# EAGLE design ATMega32U4-CC3000 (EAGLE 6.4)
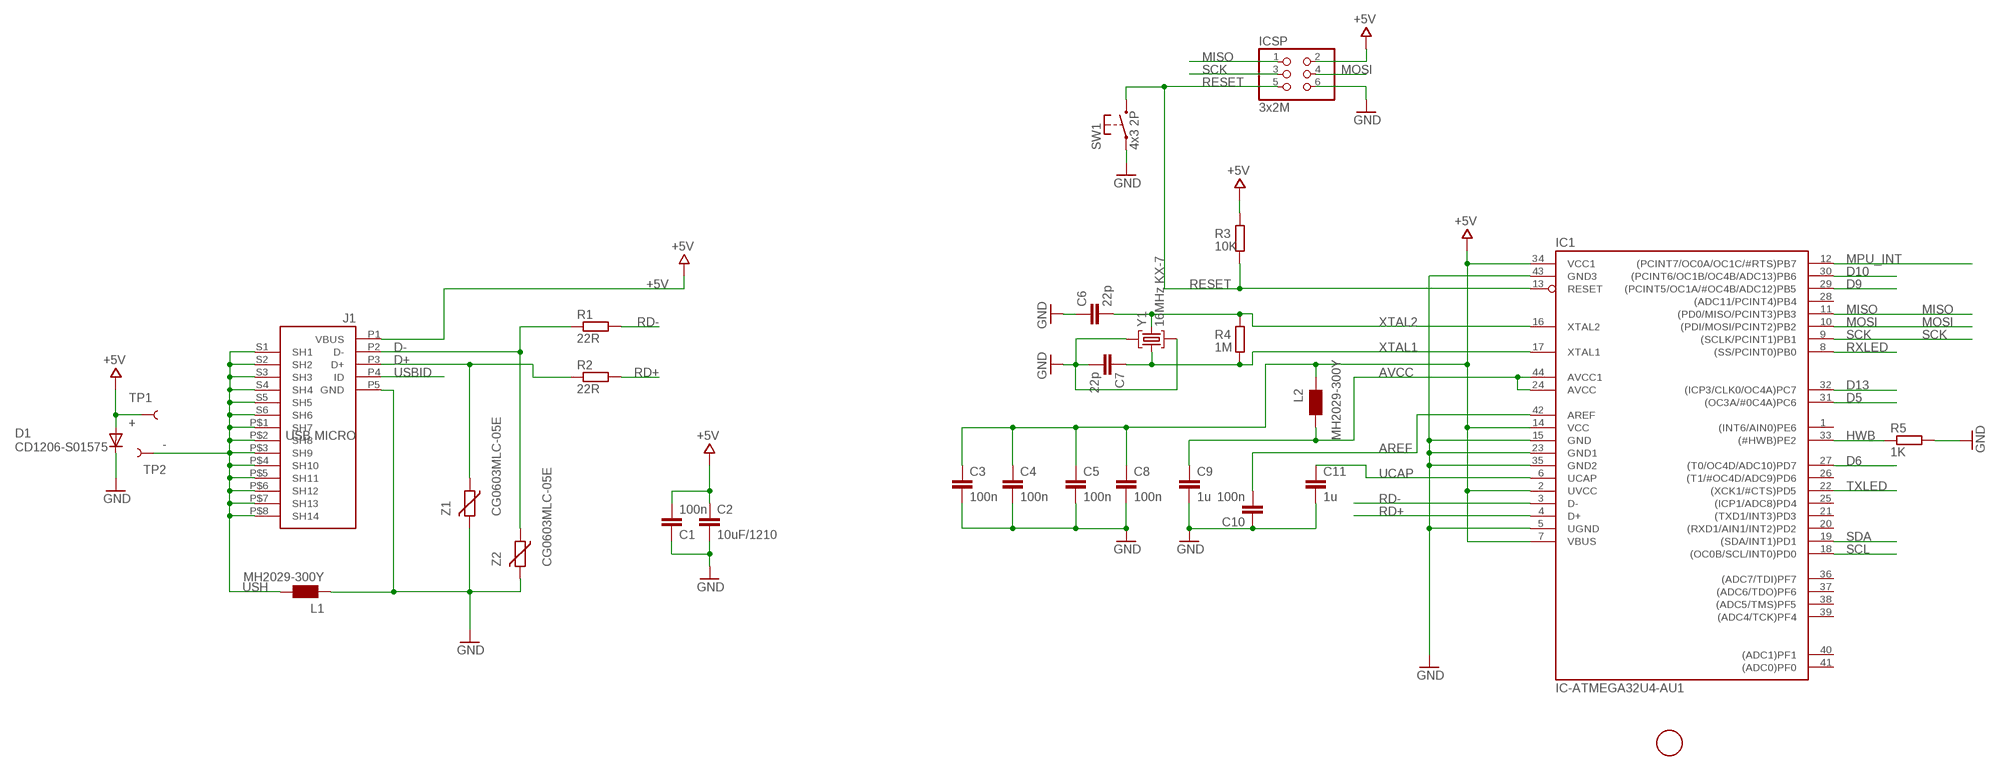
[diagram p0: schematic, sheet 1, part 1 of 2]
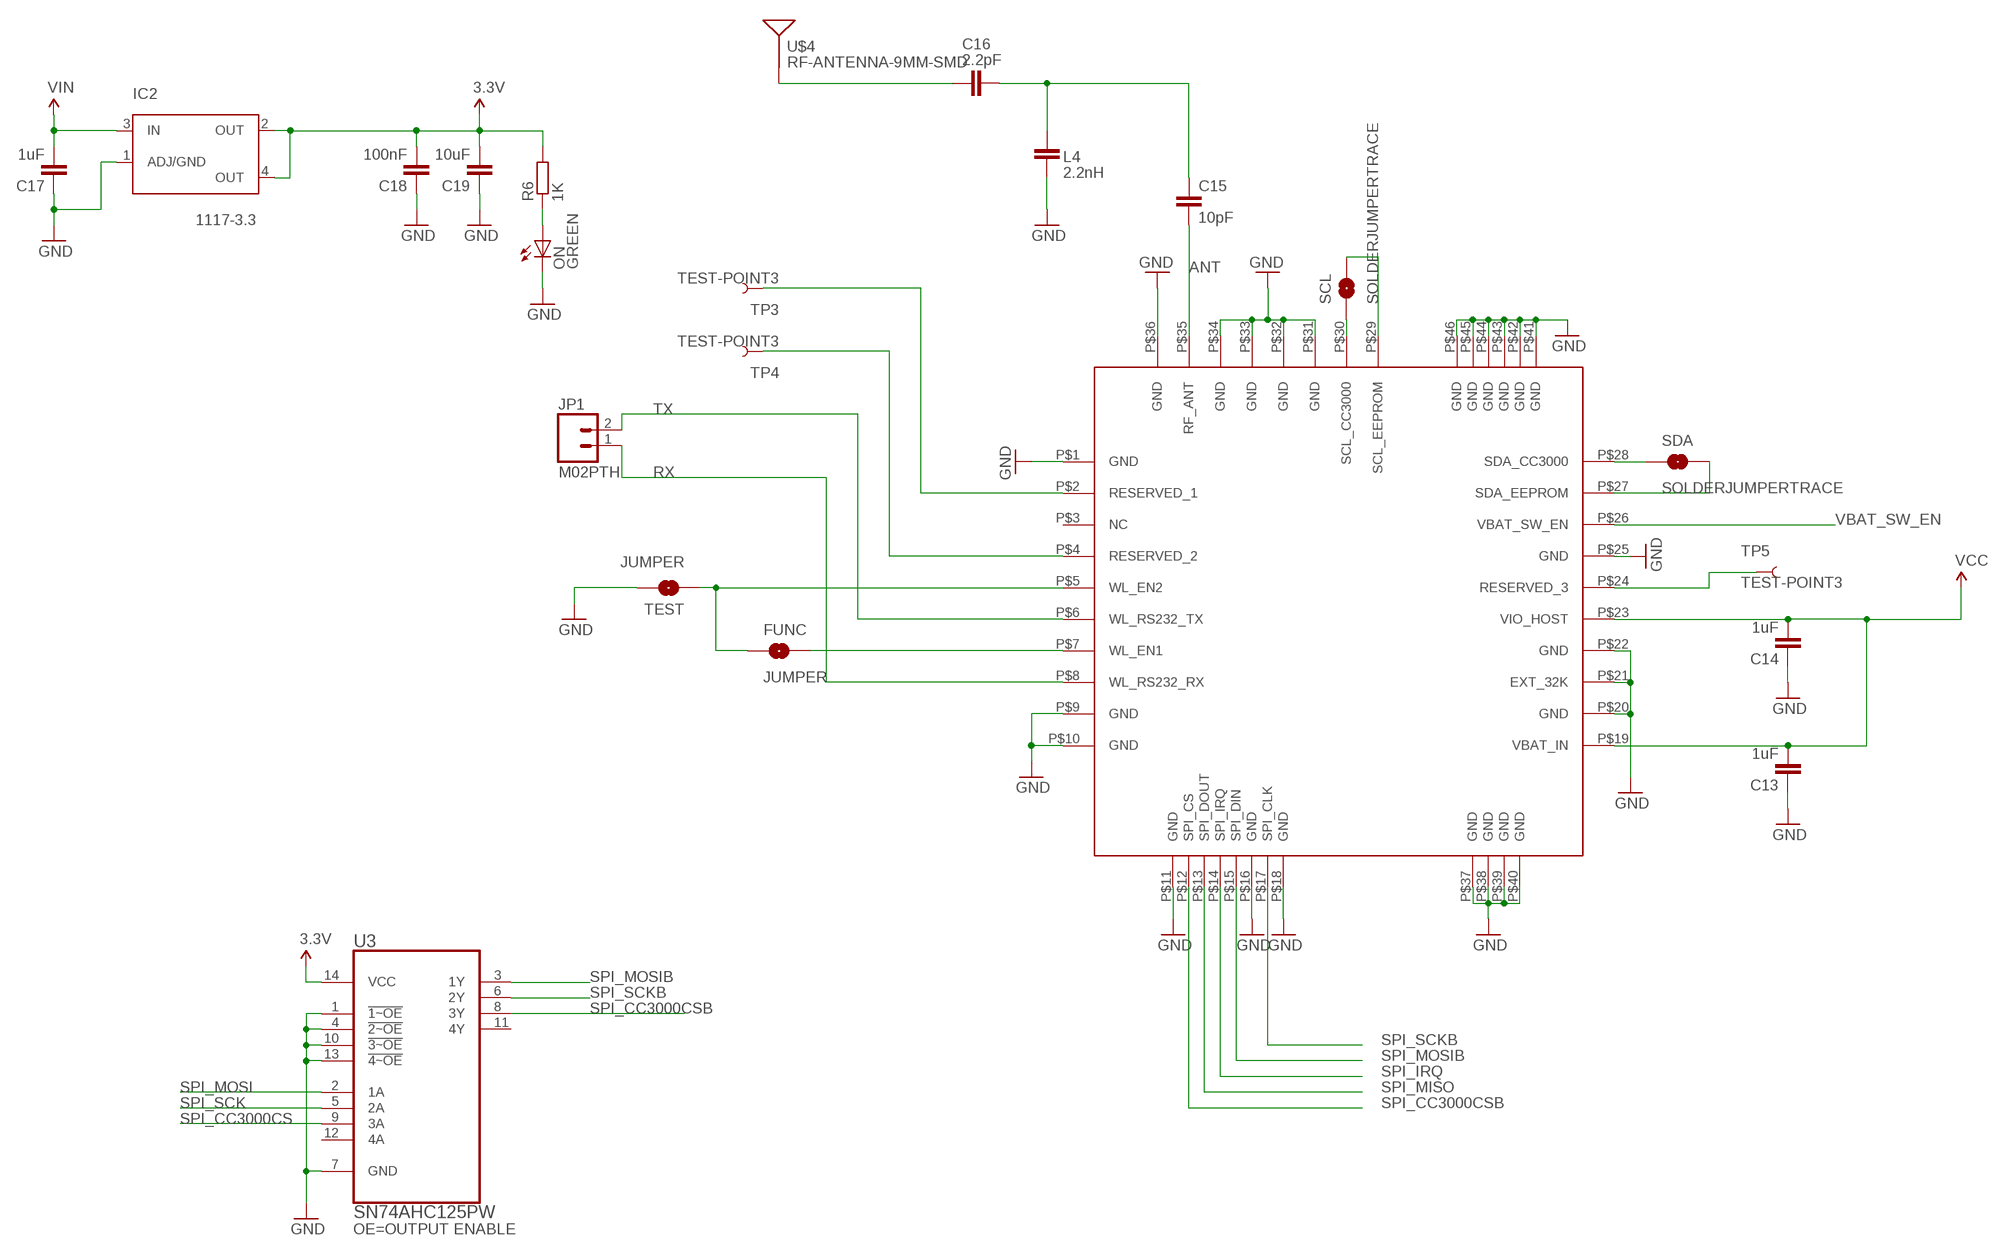
[diagram p1: schematic, sheet 1, part 2 of 2]

## Parts
C1  100n  C-EUC0603  [C0603-ROUND]
C2  10uF/1210  CAPACITOR1210  [CAP-1210_SMC-B-SMT]
C3  100n  CAPACITOR0402  [CAP-0402-SMT-ROUND]
C4  100n  CAPACITOR0402  [CAP-0402-SMT-ROUND]
C5  100n  CAPACITOR0402  [CAP-0402-SMT-ROUND]
C6  22p  CAPACITOR0402  [CAP-0402-SMT-ROUND]
C7  22p  CAPACITOR0402  [CAP-0402-SMT-ROUND]
C8  100n  CAPACITOR0402  [CAP-0402-SMT-ROUND]
C9  1u  CAPACITOR0402  [CAP-0402-SMT-ROUND]
C10  100n  CAPACITOR0402  [CAP-0402-SMT-ROUND]
C11  1u  CAPACITOR0402  [CAP-0402-SMT-ROUND]
C13  1uF  CAPACITOR0603  [CAP-0603-SMT-ROUND]
C14  1uF  CAPACITOR0603  [CAP-0603-SMT-ROUND]
C15  10pF  CAPACITOR0603  [CAP-0603-SMT-ROUND]
C16  2.2pF  CAPACITOR0603  [CAP-0603-SMT-ROUND]
C17  1uF  CAPACITOR0603  [CAP-0603-SMT-ROUND]
C18  100nF  CAPACITOR0603  [CAP-0603-SMT-ROUND]
C19  10uF  CAPACITOR1210  [CAP-1210_SMC-B-SMT]
D1  CD1206-S01575  DIODE-SWITCHINGCD1206-S01575  [DIODE-1206-SMT]
FID1  FIDUCIALMOUNT  [FIDUCIA-MOUNT]
FUNC  JUMPER  SOLDERJUMPERTRACE  [SJ_2S-TRACE]
IC1  IC-ATMEGA32U4-AU1  [QFP-10X10-44P]
IC2  1117-3.3  LDO-AMS1117-X  [LDO-SOT223]
ICSP  3x2M  PINHD-2X3  [2X03]
J1  USB MICRO  MYCON2_USB-MINI-B  [CON2_USB_MICRO_B_AT]
JP1  M02PTH  [1X02]
L1  MH2029-300Y  WE-CBF_0805  [0805]
L2  MH2029-300Y  WE-CBF_0805  [0805]
L4  2.2nH  CAPACITOR0603  [CAP-0603-SMT-ROUND]
ON  GREEN  DIODE-LED0805  [LED-0805-SMT]
R1  22R  RESISTOR0402  [RESISTOR-0402-SMT-ROUND]
R2  22R  RESISTOR0402  [RESISTOR-0402-SMT-ROUND]
R3  10K  RESISTOR0402  [RESISTOR-0402-SMT-ROUND]
R4  1M  RESISTOR0402  [RESISTOR-0402-SMT-ROUND]
R5  1K  RESISTOR0402  [RESISTOR-0402-SMT-ROUND]
R6  1K  RESISTOR0603  [RESISTOR-0603-SMT-ROUND]
SCL  SOLDERJUMPERTRACE  [SJ_2S-TRACE]
SDA  SOLDERJUMPERTRACE  [SJ_2S-TRACE]
SW1  4x3 2P  SWITCH-2P2.1-SMT  [SWITCH-2.1-SMT]
TEST  JUMPER  SOLDERJUMPERNO  [SJ_2S-NO]
TP1  +  TEST-POINT3X5  [PAD.03X.05]
TP2  -  TEST-POINT3X5  [PAD.03X.05]
TP3  TEST-POINT3  [PAD.03X.03]
TP4  TEST-POINT3  [PAD.03X.03]
TP5  TEST-POINT3  [PAD.03X.03]
U1  CC3000  [CC3000]
U3  SN74AHC125PW  IC-TI-SN74AHC125PW  [SOP65P640X120-14N]
U$4  RF-ANTENNA-9MM-SMD  [RF-ANTENNA-9MM]
Y1  16MHz KX-7  CRYSTAL-3.2-2.5  [CRYSTAL-3.2-2.5]
Z1  CG0603MLC-05E  VARISTORCN0603  [CT/CN0603]
Z2  CG0603MLC-05E  VARISTORCN0603  [CT/CN0603]

## Nets
3.3V: C13.2 C14.2 C18.2 C19.- IC2.2(OUT) IC2.4(OUT) R6.2 U1.P$19(VBAT_IN) U1.P$23(VIO_HOST) U3.14(VCC) ; supply symbol labelled VCC
+5V [vcc]: C1.2 C2.+ C3.1 C4.1 C5.1 C8.1 D1.A IC1.2(UVCC) IC1.7(VBUS) IC1.14(VCC) IC1.34(VCC1) ICSP.2 J1.P1(VBUS) L2.1 R3.1 TP1.P$1
ANT [antenna]: C15.2 U1.P$35(RF_ANT)
AREF [aref]: C10.2 IC1.42(AREF)
AVCC: C9.1 IC1.24(AVCC) IC1.44(AVCC1) L2.2
D5: IC1.31((OC3A/#0C4A)PC6)
D6: IC1.27((T0/OC4D/ADC10)PD7)
D9: IC1.29((PCINT5/OC1A/#OC4B/ADC12)PB5)
D10: IC1.30((PCINT6/OC1B/OC4B/ADC13)PB6)
D13: IC1.32((ICP3/CLK0/OC4A)PC7)
D+: J1.P3(D+) R2.1 Z1.1
D-: J1.P2(D-) R1.1 Z2.1
GND [antenna]: C1.1 C2.- C3.2 C4.2 C5.2 C6.1 C7.2 C8.2 C9.2 C10.1 C11.2 C13.1 C14.1 C17.1 C18.1 C19.+ D1.C IC1.5(UGND) IC1.15(GND) IC1.23(GND1) IC1.35(GND2) IC1.43(GND3) IC2.1(ADJ/GND) ICSP.6 J1.P5(GND) L1.1 L4.1 ON.C R5.2 SW1.1 TEST.2 U1.P$1(GND) U1.P$9(GND) U1.P$10(GND) U1.P$11(GND) U1.P$16(GND) U1.P$18(GND) U1.P$20(GND) U1.P$21(EXT_32K) U1.P$22(GND) U1.P$25(GND) U1.P$31(GND) U1.P$32(GND) U1.P$33(GND) U1.P$34(GND) U1.P$36(GND) U1.P$37(GND) U1.P$38(GND) U1.P$39(GND) U1.P$40(GND) U1.P$41(GND) U1.P$42(GND) U1.P$43(GND) U1.P$44(GND) U1.P$45(GND) U1.P$46(GND) U3.1(!1~OE) U3.4(!2~OE) U3.7(GND) U3.10(!3~OE) U3.13(!4~OE) Y1.2(GND) Y1.4(GND) Z1.2 Z2.2
HWB: IC1.33((#HWB)PE2) R5.1
MISO: IC1.11((PD0/MISO/PCINT3)PB3) ICSP.1
MOSI: IC1.10((PDI/MOSI/PCINT2)PB2) ICSP.4
MPU_INT: IC1.12((PCINT7/OC0A/OC1C/#RTS)PB7)
N$1: FUNC.2 U1.P$7(WL_EN1)
N$2: FUNC.1 TEST.1 U1.P$5(WL_EN2)
N$3 [1.8v]: TP3.P$1 U1.P$2(RESERVED_1)
N$4 [1.8v]: TP4.P$1 U1.P$4(RESERVED_2)
N$7 [1.8v]: TP5.P$1 U1.P$24(RESERVED_3)
N$8: ON.A R6.1
N$10 [antenna]: C15.1 C16.2 L4.2
N$14 [1.8v]: SCL.1 U1.P$30(SCL_CC3000)
N$15 [antenna]: C16.1 U$4.SIG(SIGNAL)
N$16 [1.8v]: SCL.2 U1.P$29(SCL_EEPROM)
N$17 [1.8v]: SDA.1 U1.P$28(SDA_CC3000)
N$18 [1.8v]: SDA.2 U1.P$27(SDA_EEPROM)
RD+: IC1.4(D+) R2.2
RD-: IC1.3(D-) R1.2
RESET: IC1.13(RESET) ICSP.5 R3.2 SW1.2
RX [1.8v]: JP1.1 U1.P$8(WL_RS232_RX)
RXLED: IC1.8((SS/PCINT0)PB0)
SCK: IC1.9((SCLK/PCINT1)PB1) ICSP.3
SCL: IC1.18((OC0B/SCL/INT0)PD0)
SDA: IC1.19((SDA/INT1)PD1)
SPI_CC3000CS: U3.9(3A)
SPI_CC3000CSB: U1.P$12(SPI_CS) U3.8(3Y)
SPI_IRQ: U1.P$14(SPI_IRQ)
SPI_MISO: U1.P$13(SPI_DOUT)
SPI_MOSI: U3.2(1A)
SPI_MOSIB: U1.P$15(SPI_DIN) U3.3(1Y)
SPI_SCK: U3.5(2A)
SPI_SCKB: U1.P$17(SPI_CLK) U3.6(2Y)
TX [1.8v]: JP1.2 U1.P$6(WL_RS232_TX)
TXLED: IC1.22((XCK1/#CTS)PD5)
UCAP: C11.1 IC1.6(UCAP)
USBID: J1.P4(ID)
USH [antenna]: J1.P$1(SH7) J1.P$2(SH8) J1.P$3(SH9) J1.P$4(SH10) J1.P$5(SH11) J1.P$6(SH12) J1.P$7(SH13) J1.P$8(SH14) J1.S1(SH1) J1.S2(SH2) J1.S3(SH3) J1.S4(SH4) J1.S5(SH5) J1.S6(SH6) L1.2 TP2.P$1
VBAT_SW_EN: U1.P$26(VBAT_SW_EN)
VIN: C17.2 IC2.3(IN)
XTAL1: C7.1 IC1.17(XTAL1) R4.1 Y1.1(C1)
XTAL2: C6.2 IC1.16(XTAL2) R4.2 Y1.3(C2)
Unconnected: IC1.1((INT6/AIN0)PE6) IC1.20((RXD1/AIN1/INT2)PD2) IC1.21((TXD1/INT3)PD3) IC1.25((ICP1/ADC8)PD4) IC1.26((T1/#OC4D/ADC9)PD6) IC1.28((ADC11/PCINT4)PB4) IC1.36((ADC7/TDI)PF7) IC1.37((ADC6/TDO)PF6) IC1.38((ADC5/TMS)PF5) IC1.39((ADC4/TCK)PF4) IC1.40((ADC1)PF1) IC1.41((ADC0)PF0) U1.P$3(NC) U3.11(4Y) U3.12(4A)

## Library data of the parts
C1 = SmartPrj:C-EU: CAPACITOR, European symbol
C2-C11 C13-C19 L4 = TONYLABS:CAPACITOR: CAPACITOR
D1 = TONYLABS:DIODE-SWITCHING: Diode; DATASHEET: http://www.bourns.com/data/global/pdfs/cd0805_1206.pdf; FUNCTION: Switching Chip Diode; MAX_VOLTAGE: 75V; PACKAGE: 1206; SUPLLIER: BOURNS
FID1 = SmartPrj:FIDUCIALMOUNT
FUNC SCL SDA = SparkFun-Passives:SOLDERJUMPER: Solder Jumper Standard SMD solder jumper. Used to automate production. Two varients : Normally Open and Normally Closed are the same, but have different paste layers. NC will have a large amount of paste and should jumper during reflow.
IC1 = TONYLABS:IC-ATMEGA32U4-AU: 8-bit Microcontroller with ISP Flash and USB Controller
IC2 = TONYLABS:LDO-AMS1117-X: LDO Chip AMS1117-x series
ICSP = SmartPrj:PINHD-2X3: PIN HEADER
J1 = SmartPrj:MYCON2_USB-MINI-B
JP1 = SparkFun-Connectors:M02: Standard 2-pin 0.1" header. Use with - straight break away headers ( PRT-00116) - right angle break away headers (PRT-00553) - swiss pins (PRT-00743) - machine pins (PRT-00117) - female headers (PRT-00115) Molex polarized connector foot print use with: PRT-08233 with associated crimp pins and housings. 2.54_SCREWTERM for use with PRT-10571. 3.5mm Screw Terminal footprints for PRT-08084 5mm Screw Terminal footprints for use with PRT-08433
L1 L2 = wuerth-elektronik:WE-CBF: SMD EMI Suppression Ferrite Beads - excellent anti-EMI properties - low DCR - impedances till 3000 ohms - rated current up to 6 A
ON = TONYLABS:DIODE-LED: LED Diode; PACKAGE: 0805
R1-R5 = TONYLABS:RESISTOR: Resistor SMT; PACKAGE: 0402
R6 = TONYLABS:RESISTOR: Resistor SMT; PACKAGE: 0603
SW1 = TONYLABS:SWITCH-2P: Switch SMT
TEST = SparkFun:SOLDERJUMPER: Solder Jumper Standard SMD solder jumper. Used to automate production. Two varients : Normally Open and Normally Closed are the same, but have different paste layers. NC will have a large amount of paste and should jumper during reflow.
TP1-TP5 = SparkFun-Passives:TEST-POINT: Bare copper test points for troubleshooting or ICT
U1 = centerblack_engineering:CC3000: TI SimpleLink CC3000 Module - WiFi 802.11b/g Network Processor; AUTHOR: Matt Bigarani; DATASHEET: http://www.ti.com/lit/ds/symlink/cc3000.pdf; DATE: 2/8/2013
U3 = TONYLABS:IC-TI-SN74AHC125PW: QUADRUPLE BUS BUFFER GATES WITH 3-STATE OUTPUTS; MPN: SN74AHC125PW; OC_FARNELL: 1470744; OC_NEWARK: 35K0768; PACKAGE: TSSOP-14; SUPPLIER: TEXAS INSTRUMENTS
U$4 = TONYLABS:RF-ANTENNA-9MM-SMD
Y1 = SmartPrj:CRYSTAL-3.2-2.5
Z1 Z2 = varistor:VARISTOR: VARISTOR

## Net classes
0 default: width 0.203 mm, clearance 0.203 mm
1 vcc: width 1.016 mm, clearance 0.203 mm
2 antenna: width 0.363 mm, clearance 0.305 mm
3 1.8v: width 0.457 mm, clearance 0.254 mm
4 aref: width 0.254 mm, drill 0.61 mm, clearance 0.254 mm

## Board
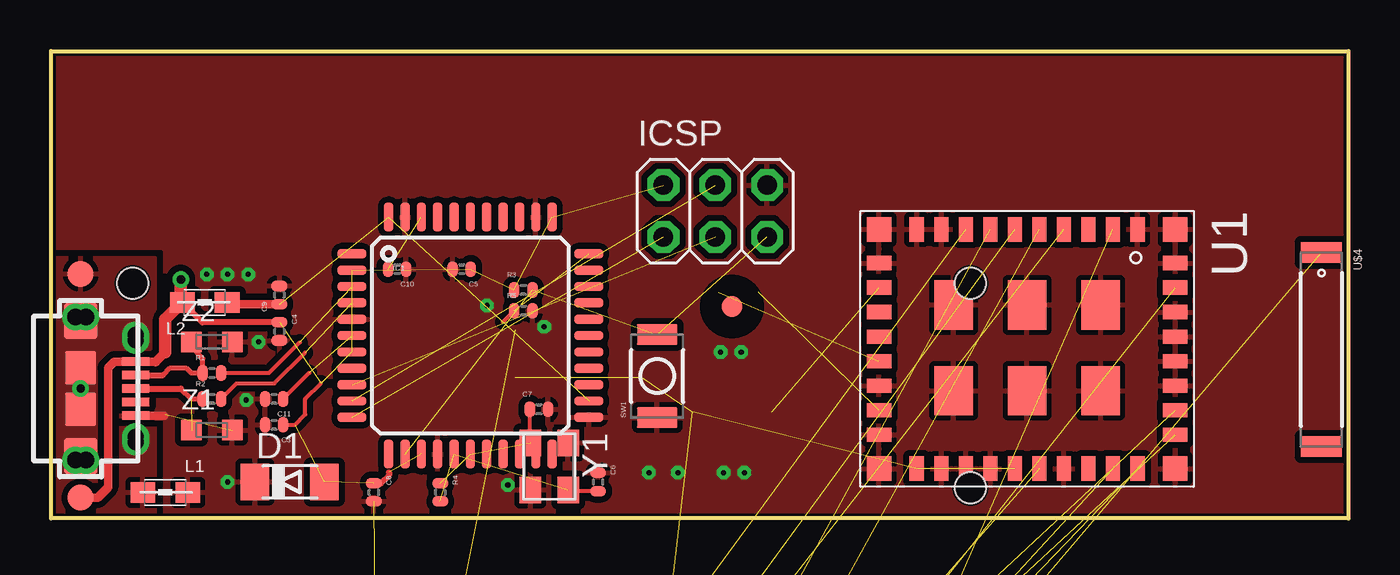
[diagram p2: board, top side]
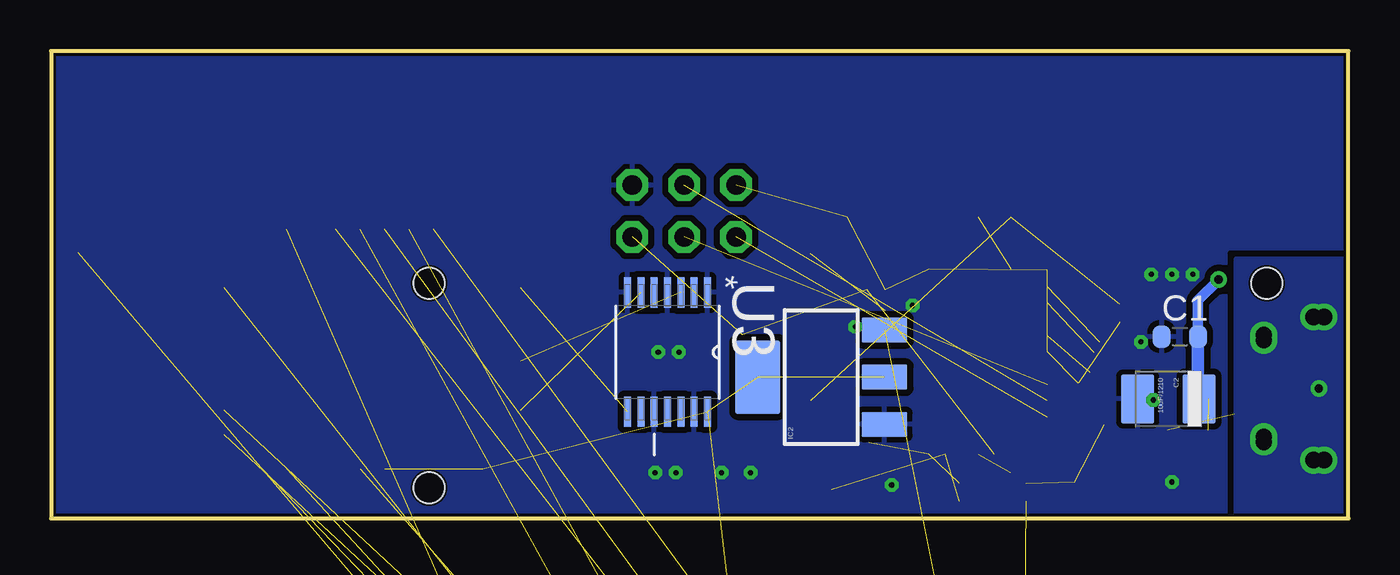
[diagram p3: board, bottom side, seen from below]

Size 63.5 x 22.86 mm. Coordinates in mm from the lower left corner, seen from the top.
Outline: 0,0 0,22.86 63.5,22.86 63.5,0 0,0
Copper layers (1*16): Top 0.035mm / dielectric 1.5mm / Bottom 0.035mm
Design rules "default *": minimum track width 8mil, minimum drill 10mil, track to track 8mil, track to pad 8mil, pad to pad 8mil, via to via 8mil, smd to smd 8mil, copper to edge 5mil, drill to drill 8mil, minimum pad ring 10mil, minimum via ring 8mil, stop-mask expansion 4mil, vias tented up to drill 30mil, thermal gap 10mil
Holes 1.5 mm at 45,11.5 4,11.5 45,1.5

### Footprints (pad centres in the part's own frame; a part is rotated, then mirrored left to right if it is on the bottom)
C0603-ROUND = smd 0.898 x 1.1: 1 -0.889,0; 2 0.889,0
CAP-1210_SMC-B-SMT = smd 1.6 x 2.4: + -1.5,0; - 1.5,0
CAP-0402-SMT-ROUND = smd 0.508 x 0.762: 1 -0.445,0; 2 0.445,0
CAP-0603-SMT-ROUND = smd 0.898 x 1.1: 1 -0.889,0; 2 0.889,0
DIODE-1206-SMT = smd 1.4 x 1.8: A 1.7,0; C -1.7,0
FIDUCIA-MOUNT = smd 1.016 x 1.016: P$1 0,0
SJ_2S-TRACE = smd 0.635 x 1.27: 1 -0.508,0; 2 0.508,0
QFP-10X10-44P = smd 1.4 x 0.45: 1 -5.8,4; 2 -5.8,3.2; 3 -5.8,2.4; 4 -5.8,1.6; 5 -5.8,0.8; 6 -5.8,0; 7 -5.8,-0.8; 8 -5.8,-1.6; 9 -5.8,-2.4; 10 -5.8,-3.2; 11 -5.8,-4; 23 5.8,-4; 24 5.8,-3.2; 25 5.8,-2.4; 26 5.8,-1.6; 27 5.8,-0.8; 28 5.8,0; 29 5.8,0.8; 30 5.8,1.6; 31 5.8,2.4; 32 5.8,3.2; 33 5.8,4 | smd 0.45 x 1.4: 12 -4,-5.8; 13 -3.2,-5.8; 14 -2.4,-5.8; 15 -1.6,-5.8; 16 -0.8,-5.8; 17 0,-5.8; 18 0.8,-5.8; 19 1.6,-5.8; 20 2.4,-5.8; 21 3.2,-5.8; 22 4,-5.8; 34 4,5.8; 35 3.2,5.8; 36 2.4,5.8; 37 1.6,5.8; 38 0.8,5.8; 39 0,5.8; 40 -0.8,5.8; 41 -1.6,5.8; 42 -2.4,5.8; 43 -3.2,5.8; 44 -4,5.8
LDO-SOT223 = smd 1.219 x 2.235: 1 -2.311,-3.099; 2 0,-3.099; 3 2.311,-3.099 | smd 3.6 x 2.2: 4 0,3.099
2X03 = drill 0.95 pad 1.55 octagon: 1 -2.54,-1.27; 2 -2.54,1.27; 3 0,-1.27; 4 0,1.27; 5 2.54,-1.27; 6 2.54,1.27
CON2_USB_MICRO_B_AT = smd 0.406 x 1.346: P1 -1.321,2.692; P2 -0.66,2.692; P3 0,2.692; P4 0.66,2.692; P5 1.321,2.692 | drill 0.8 pad 1.27: P$1 -2.616,2.692 | drill 0.8 pad 1.245: P$2 -2.362,2.692; P$7 2.362,2.692; P$8 2.616,2.692 | drill 0.8 pad 1.143: P$3 -3.505,-0.254; P$4 -3.505,0.254; P$5 3.505,0.254; P$6 3.505,-0.254 | smd 1.778 x 1.651: S1 -3.302,0; S2 3.302,0 | smd 1.524 x 1.27: S3 -2.489,2.692; S4 2.489,2.692 | smd 1.626 x 1.524: S5 -1.016,0; S6 1.016,0
1X02 = drill 1.016 pad 1.88: 1 0,0; 2 2.54,0
0805 = smd 1.2 x 1: 1 -1.1,0; 2 1.1,0
LED-0805-SMT = smd 1.2 x 1.2: A 0,-1.05; C 0,1.05
RESISTOR-0402-SMT-ROUND = smd 0.508 x 0.762: 1 -0.445,0; 2 0.445,0
RESISTOR-0603-SMT-ROUND = smd 0.898 x 1.1: 1 -0.889,0; 2 0.889,0
SWITCH-2.1-SMT = smd 1.016 x 1.981: 1 -2.032,0; 2 2.032,0
SJ_2S-NO = smd 0.635 x 1.27: 1 -0.45,0; 2 0.45,0
PAD.03X.05 = smd 1.27 x 1.27: P$1 0,0
PAD.03X.03 = smd 0.762 x 0.762: P$1 0,0
CC3000 = smd 1.2 x 0.7: P$1 0.9,13.55; P$2 0.9,12.35; P$3 0.9,11.15; P$4 0.9,9.95; P$5 0.9,8.75; P$6 0.9,7.55; P$7 0.9,6.35; P$8 0.9,5.15; P$9 0.9,3.95; P$10 0.9,2.75; P$19 12.6,2.75; P$20 12.6,3.95; P$21 12.6,5.15; P$22 12.6,6.35; P$23 12.6,7.55; P$24 12.6,8.75; P$25 12.6,9.95; P$26 12.6,11.15; P$27 12.6,12.35; P$28 12.6,13.55 | smd 0.7 x 1.2: P$11 2.55,0.9; P$12 3.75,0.9; P$13 4.95,0.9; P$14 6.15,0.9; P$15 7.35,0.9; P$16 8.55,0.9; P$17 9.75,0.9; P$18 10.95,0.9; P$29 10.95,15.4; P$30 9.75,15.4; P$31 8.55,15.4; P$32 7.35,15.4; P$33 6.15,15.4; P$34 4.95,15.4; P$35 3.75,15.4; P$36 2.55,15.4 | smd 2.4 x 1.9: P$37 4.6,11.75; P$38 4.6,8.15; P$39 4.6,4.55; P$40 8.8,11.75; P$41 8.8,8.15; P$42 8.8,4.55 | smd 1.2 x 1.2: P$43 0.9,15.4; P$44 0.9,0.9; P$45 12.6,0.9; P$46 12.6,15.4
SOP65P640X120-14N = smd 1.473 x 0.356: 1 -2.921,1.956; 2 -2.921,1.295; 3 -2.921,0.66; 4 -2.921,0; 5 -2.921,-0.66; 6 -2.921,-1.295; 7 -2.921,-1.956; 8 2.921,-1.956; 9 2.921,-1.295; 10 2.921,-0.66; 11 2.921,0; 12 2.921,0.66; 13 2.921,1.295; 14 2.921,1.956
RF-ANTENNA-9MM = smd 1 x 2: NC 9.5,0; SIG 0,0
CRYSTAL-3.2-2.5 = smd 1.3 x 1.05: 1 -1.15,-0.925; 2 1.15,-0.925; 3 1.15,0.925; 4 -1.15,0.925
CT/CN0603 = smd 1 x 1: 1 -1,0; 2 1,0

### Placement (x,y rotation side)
C1  8.26,8.89 0 bottom
C2  8.81,5.84 180 bottom
C3  10.92,4.57 180 top
C4  11.18,9.14 270 top
C5  20.09,12.19 180 top
C6  26.77,1.78 270 top
C7  23.88,5.33 0 top
C8  15.8,1.27 270 top
C9  11.18,10.92 90 top
C10  16.94,12.19 180 top
C11  10.92,5.84 180 top
C13  -4.88,-54.66 0 top  (outside the outline)
C14  -1.42,-54.66 0 top  (outside the outline)
C15  2.03,-54.66 0 top  (outside the outline)
C16  5.49,-54.66 0 top  (outside the outline)
C17  8.94,-54.66 0 top  (outside the outline)
C18  12.4,-54.66 0 top  (outside the outline)
C19  23.57,-48.97 0 top  (outside the outline)
D1  11.68,1.78 0 top
FID1  33.32,10.36 0 top
FUNC  9.75,-51.21 0 top  (outside the outline)
IC1  20.52,8.94 0 top
IC2  25.81,6.91 90 bottom
ICSP  32.51,15.04 0 top
J1  1.45,6.35 270 top
JP1  2.03,-44.09 0 top  (outside the outline)
L1  5.59,1.27 180 top
L2  7.52,10.57 0 top
L4  15.85,-54.66 0 top  (outside the outline)
ON  16.26,-51 0 top  (outside the outline)
R1  7.87,7.11 0 top
R2  7.87,5.84 0 top
R3  23.11,11.18 0 top
R4  19.05,1.27 270 top
R5  23.11,10.16 0 top
R6  19.3,-54.66 0 top  (outside the outline)
SCL  -5.28,-51.21 0 top  (outside the outline)
SDA  2.24,-51.21 0 top  (outside the outline)
SW1  29.67,6.96 90 top
TEST  12.8,-51.21 0 top  (outside the outline)
TP1  1.45,1.02 0 top
TP2  1.45,11.96 0 top
TP3  21.95,-54.46 0 top  (outside the outline)
TP4  -5.69,-56.9 0 top  (outside the outline)
TP5  -3.66,-56.9 0 top  (outside the outline)
U1  39.62,15.04 270 top
U3  33.32,8.13 270 bottom
U$4  62.18,13 270 top
Y1  24.38,2.54 270 top
Z1  7.87,4.32 0 top
Z2  7.87,8.64 0 top

### Tracks (layer width: path | path; a pad name or v marks a point on that pad's centre or on a via)
3.3V  (9 unrouted)
+5V  (via drill 0.41)  (10 unrouted)
  Top 0.203: C3.1 11.94,4.57 12.45,5.08 12.45,5.84 13.22,6.61 | C5.1
  Top 0.305: C4.1 7.4,9.59 L2.1 | 16.53,2.25 16.53,2.11 16.14,1.71 C8.1
  Top 0.406: 5.13,7.67 J1.P1 3.1,7.67 2.79,7.37 2.79,1.52 2.29,1.02 TP1.P$1
  Top 0.457: 5.13,7.67 5.59,8.13
  Top 0.61: 5.59,8.13 5.59,9.74 L2.1 6.35,10.63 v6.35,11.68
  Bottom 0.508: C1.2 7.37,10.67 v6.35,11.68
  Bottom 0.61: C1.2 7.37,5.89 C2.+
ANT  (1 unrouted)
AREF  (1 unrouted)
  Top 0.203: 16.53,11.93 C10.2
AVCC  (2 unrouted)
  Top 0.406: C9.1 8.71,10.48 L2.2
D+  (1 unrouted)
  Top 0.254: 6.35,6.35 6.86,5.84 R2.1
  Top 0.305: J1.P3 6.35,6.35
D-
  Top 0.254: 5.49,7.01 5.84,7.37 6.6,7.37 6.86,7.11 R1.1 7.43,7.81 6.87,8.37 Z2.1
  Top 0.305: J1.P2 5.49,7.01
GND  (via drill 0.25)  (9 unrouted)
  Top 0.254: 5.54,5.03 5.59,5.08
  Top 0.406: J1.P5 5.54,5.03
  other vias: 7.62,11.94 8.64,1.78 22.35,1.63 10.16,8.64 8.64,11.94 9.65,11.94 32.77,8.13 33.78,8.13 32.92,2.24 24.13,9.37 21.34,10.41 30.68,2.24 29.26,2.24 33.93,2.24 9.55,5.79
  pour Top (rank 2): -1.27,-0.76 64.9,-0.76 64.9,22.86 -1.27,22.86
  pour Bottom (rank 2): -1.27,-0.76 -1.27,22.86 64.77,22.86 64.77,-0.76
HWB  (1 unrouted)
  Top 0.203: 22.12,9.61 R5.1
MISO  (1 unrouted)
MOSI  (1 unrouted)
N$1  (1 unrouted)
N$2  (2 unrouted)
N$3  (1 unrouted)
N$4  (1 unrouted)
N$7  (1 unrouted)
N$8  (1 unrouted)
N$10  (2 unrouted)
N$14  (1 unrouted)
N$15  (1 unrouted)
N$16  (1 unrouted)
N$17  (1 unrouted)
N$18  (1 unrouted)
RD+  (1 unrouted)
  Top 0.203: R2.2 9.08,6.6 10.92,6.6 12.43,8.11
RD-  (1 unrouted)
  Top 0.203: R1.2 10.67,7.11 12.17,8.61
RESET  (3 unrouted)
RX  (1 unrouted)
SCK  (1 unrouted)
SPI_CC3000CSB  (1 unrouted)
SPI_MOSIB  (1 unrouted)
SPI_SCKB  (1 unrouted)
TX  (1 unrouted)
UCAP  (1 unrouted)
  Top 0.203: 12.64,7.11 C11.1
USH  (via drill 0.41)
  Top 0.406: 1.22,9.2 J1.S1
  Top 0.61: 1.47,2.39 J1.P$5 | J1.P$1 J1.S3
  other vias: 1.45,6.35
  pour Top: 0,12.7 0,0 5.08,0 5.08,12.7
  pour Bottom: 0,12.7 0,0 5.49,0 5.49,12.7
VIN  (1 unrouted)
XTAL1  (2 unrouted)
  Top 0.203: C7.1 23.43,4.23 Y1.1
XTAL2  (2 unrouted)
  Top 0.203: C6.2 25.37,1.33 Y1.3

### Text on the board
tStop: iMO
_tsilk: +
_bsilk: SCL | SDA | 3.3 | TONYLABS | EXCLUSIVE CREATION BACKEND